# Altium schematic sheet relay_driver.SchDoc
size A4
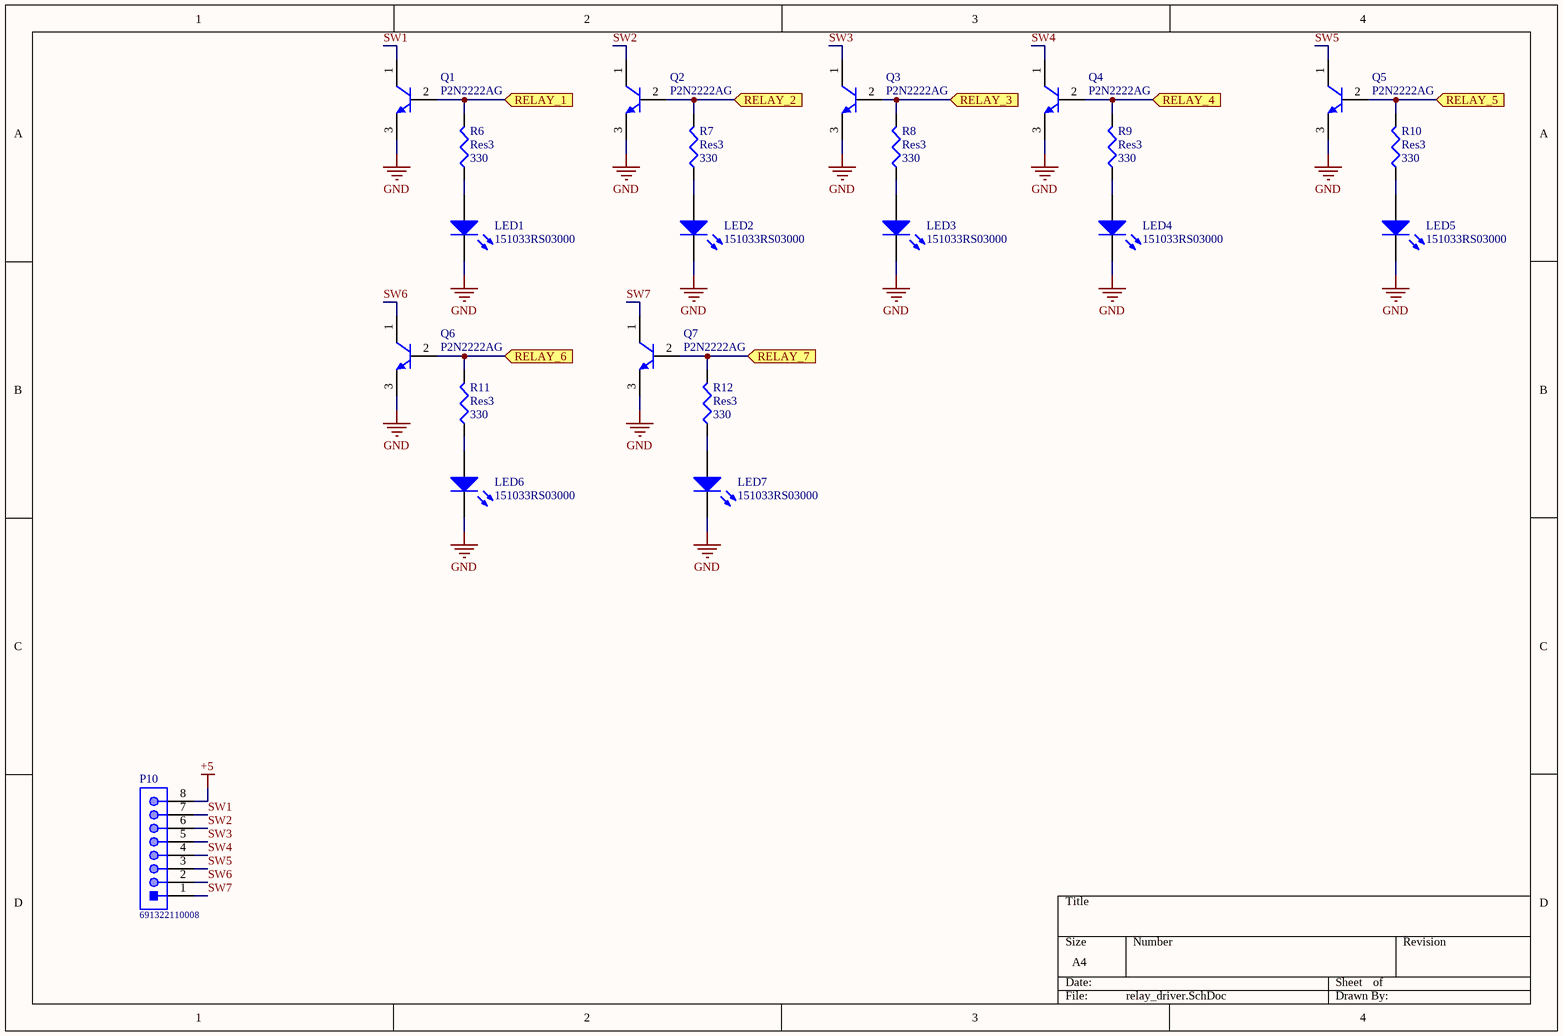
[diagram p0: relay_driver.SchDoc]

## Parts
LED1  151033RS03000  [Type 3mm]
LED2  151033RS03000  [Type 3mm]
LED3  151033RS03000  [Type 3mm]
LED4  151033RS03000  [Type 3mm]
LED5  151033RS03000  [Type 3mm]
LED6  151033RS03000  [Type 3mm]
LED7  151033RS03000  [Type 3mm]
P10  691322110008  [691322110008]
Q1  P2N2222AG  [ONSC-TO-92-3-29-11]
Q2  P2N2222AG  [ONSC-TO-92-3-29-11]
Q3  P2N2222AG  [ONSC-TO-92-3-29-11]
Q4  P2N2222AG  [ONSC-TO-92-3-29-11]
Q5  P2N2222AG  [ONSC-TO-92-3-29-11]
Q6  P2N2222AG  [ONSC-TO-92-3-29-11]
Q7  P2N2222AG  [ONSC-TO-92-3-29-11]
R6  Res3  value 330  [AXIAL-0.3]
R7  Res3  value 330  [AXIAL-0.3]
R8  Res3  value 330  [AXIAL-0.3]
R9  Res3  value 330  [AXIAL-0.3]
R10  Res3  value 330  [AXIAL-0.3]
R11  Res3  value 330  [AXIAL-0.3]
R12  Res3  value 330  [AXIAL-0.3]

## Ports
RELAY_1 (in), RELAY_2 (in), RELAY_3 (in), RELAY_4 (in), RELAY_5 (in), RELAY_6 (in), RELAY_7 (in)

## Nets
+5: P10.8
GND: LED1.1(K) LED2.1(K) LED3.1(K) LED4.1(K) LED5.1(K) LED6.1(K) LED7.1(K) Q1.3(E) Q2.3(E) Q3.3(E) Q4.3(E) Q5.3(E) Q6.3(E) Q7.3(E)
RELAY_1: Q1.2(B) R6.2 ; port RELAY_1
RELAY_2: Q2.2(B) R7.2 ; port RELAY_2
RELAY_3: Q3.2(B) R8.2 ; port RELAY_3
RELAY_4: Q4.2(B) R9.2 ; port RELAY_4
RELAY_5: Q5.2(B) R10.2 ; port RELAY_5
RELAY_6: Q6.2(B) R11.2 ; port RELAY_6
RELAY_7: Q7.2(B) R12.2 ; port RELAY_7
SW1: P10.7 Q1.1(C)
SW2: P10.6 Q2.1(C)
SW3: P10.5 Q3.1(C)
SW4: P10.4 Q4.1(C)
SW5: P10.3 Q5.1(C)
SW6: P10.2 Q6.1(C)
SW7: P10.1 Q7.1(C)
NetLED1_2: LED1.2(A) R6.1
NetLED2_2: LED2.2(A) R7.1
NetLED3_2: LED3.2(A) R8.1
NetLED4_2: LED4.2(A) R9.1
NetLED5_2: LED5.2(A) R10.1
NetLED6_2: LED6.2(A) R11.1
NetLED7_2: LED7.2(A) R12.1

## Library data of the parts
LED1-LED7 = CMP-1489-00004-1: THT LED round mono-color waterclear, WL-TMRW, Red; Manufacturer: Wuerth Elektronik; ComponentLink1URL: http://www.we-online.com; PartNumber: 151033RS03000; ComponentLink1Description: Manufacturer URL; PackageReference: Type 3mm; ComponentLink2Description: Datasheet; Emitting color: Red; ComponentLink2URL: http://katalog.we-online.de/pbs/datasheet/7448042001.pdfhttp://katalog.we-online.de/pbs/datasheet/7448042001.pdfhttp://katalog.we-online.de/pbs/datasheet/7448042001.pdfhttp://katalog.we-online.de/pbs/datasheet/151033RS03000.pdf
P10 = CMP-1502-01797-1: Serie 3221 - 3.50mm Horizontal PCB Header WR-TBL, 8 pin; Manufacturer: Wurth Elektronik; Pin Number: 8; Gender: Male; Packaging: Box; Publisher: WurthElektronik; Pitch: 3.50mm; Mounting Technology: THT; Datasheet URL: http://katalog.we-online.de/em/datasheet/6913221100xx.pdf; Operating Temperature: -40to105degC; Manufacturer URL: http://www.we-online.de; Package Reference: 691322110008; Part Number: 691322110008
Q1-Q7 = CMP-1048-01402-1: Amplifier Transistor, NPN Silicon, 3-Pin TO-92, Pb-Free, Bulk Box; Manufacturer: On Semiconductor; IC Continuous (A): 0.6; fT Min (MHz): 300; ComponentLink2Description: Datasheet; ComponentLink1Description: Manufacturer URL; ComponentLink2URL: http://www.onsemi.com/pub_link/Collateral/P2N2222A-D.PDF; ComponentLink3Description: Package Specification; RoHS: TRUE; ComponentLink1URL: http://www.onsemi.com/; PartNumber: P2N2222AG; Mounting Technology: Through Hole; PackageReference: TO-92-3-29-11_AM_SL; Polarity: NPN; Packing: Bulk Box; DatasheetVersion: Rev. 7; PackageDescription: 3-Pin Transistor Outline, Body 4.825 x 3.685 mm, Pitch 1.27 mm; PackageVersion: Rev. AM; ComponentLink3URL: http://www.onsemi.cn/pub_link/Collateral/2N6426-D.PDF
R6-R12 = Res3: Resistor; Published: 8-Jun-2000; LatestRevisionDate: 29-May-2009; LatestRevisionNote: IPC-7351 Footprint Added.; PackageReference: J1-0603; Publisher: Altium Limited; PackageDescription: Chip Resistor